# EAGLE design PCB-SSB-1x1ENC (EAGLE 7.5.0)

## Sheet 1 of 2
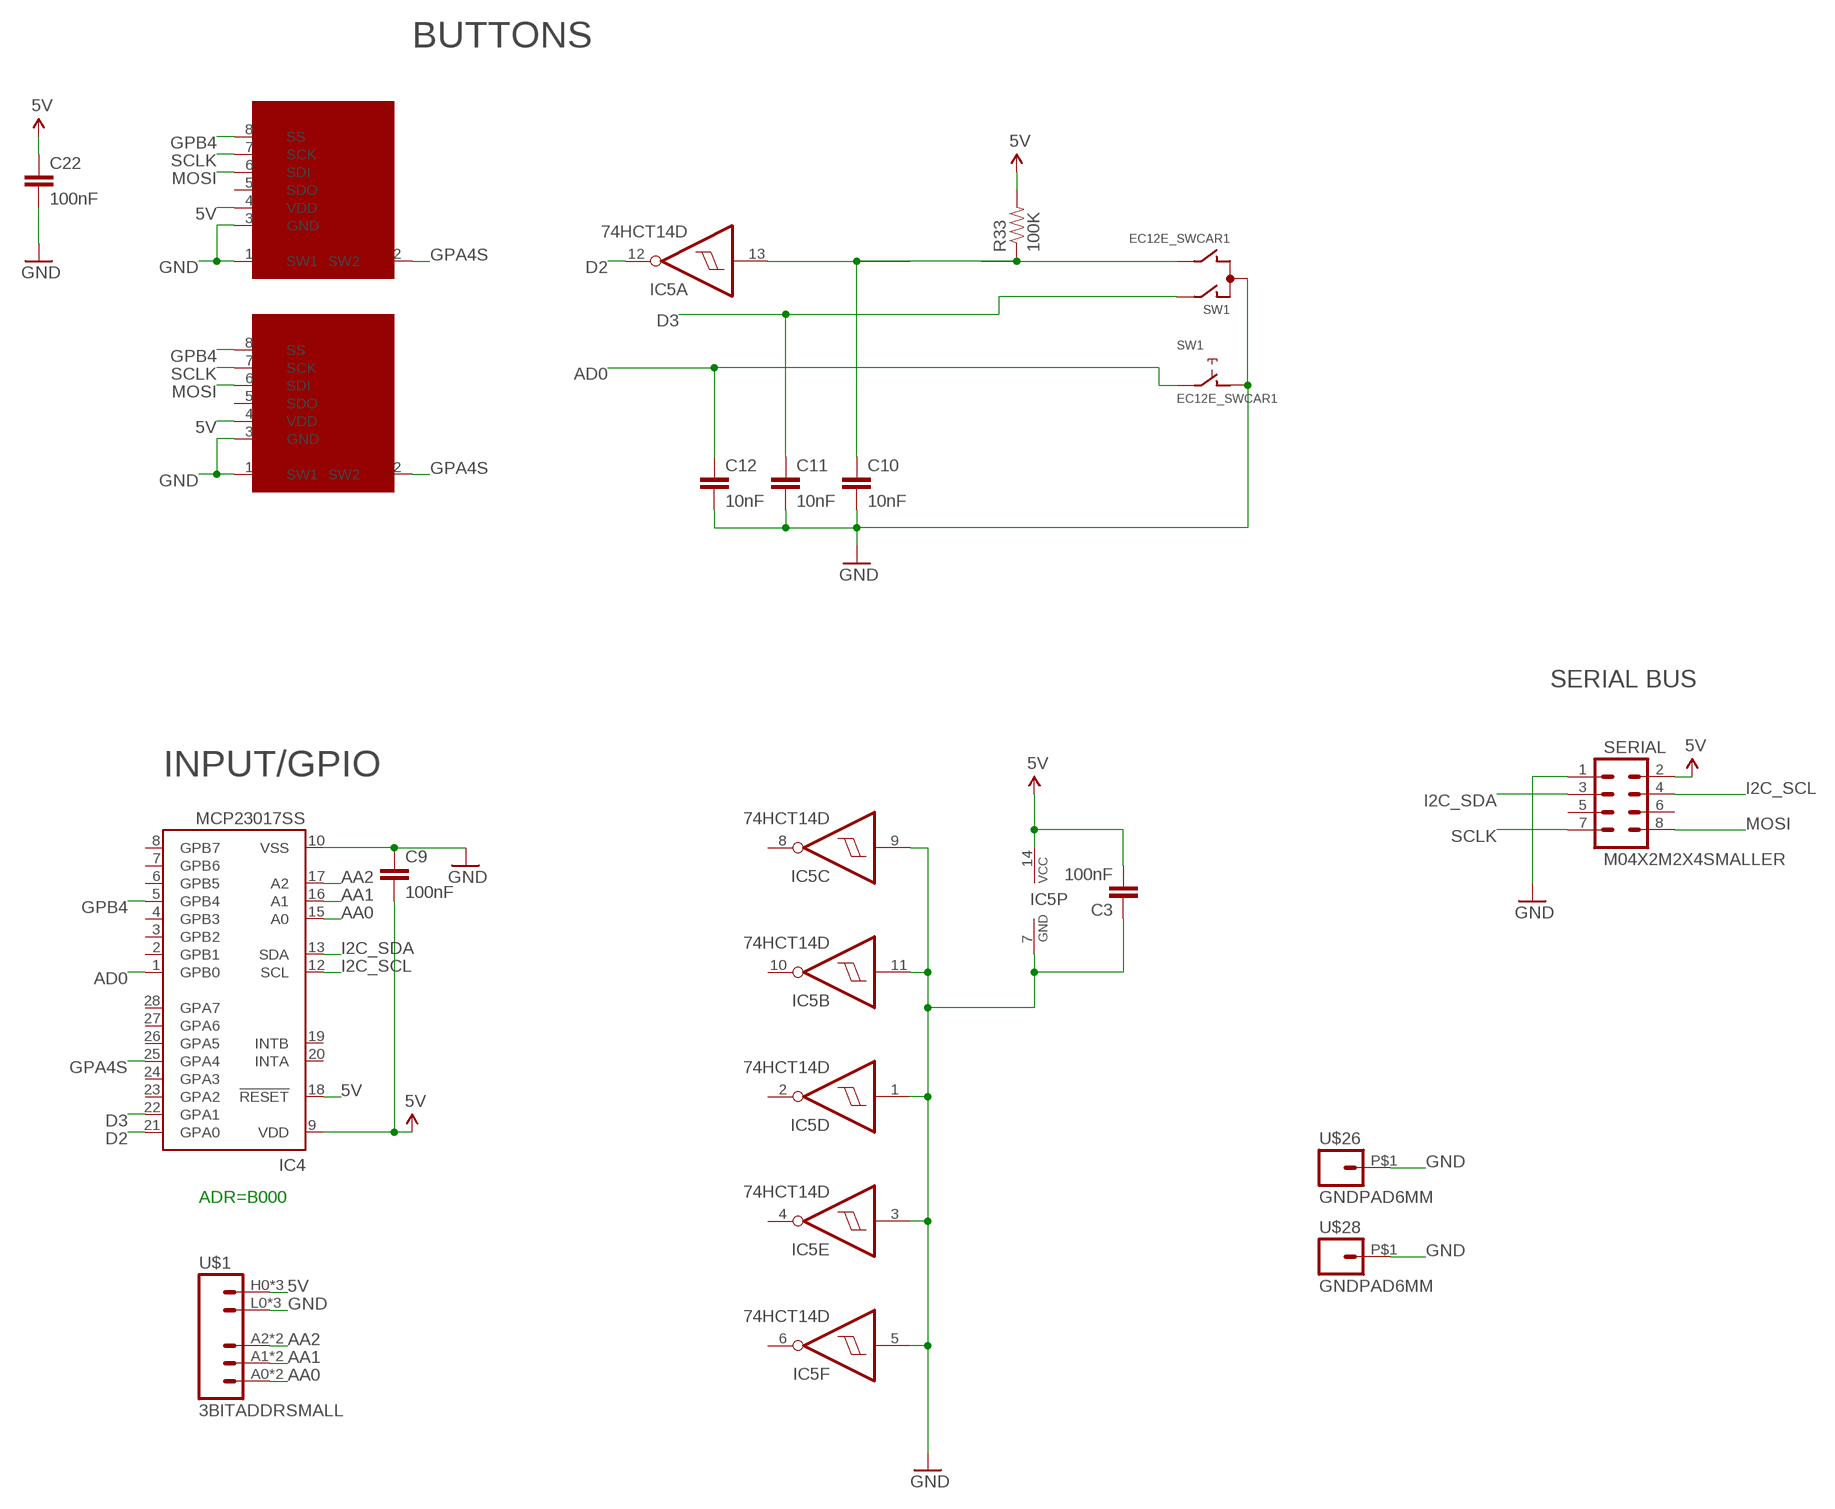
[diagram p0: schematic, sheet 1]

### Parts
C3  100nF  CAP0603-CAP  [0603-CAP]
C9  100nF  CAP0603-CAP  [0603-CAP]
C10  10nF  CAP0603-CAP  [0603-CAP]
C11  10nF  CAP0603-CAP  [0603-CAP]
C12  10nF  CAP0603-CAP  [0603-CAP]
C22  100nF  CAP0603-CAP  [0603-CAP]
IC4  MCP23017SS  [SSOP28]
IC5  74HCT14D  [SO14]
R33  100K  RESISTOR0603-RES  [0603-RES]
SERIAL  M04X2M2X4SMALLER  [M2X4SMALLER]
SSW1  SMART_SWITCHSMART_SWITCH_8PIN  [SMART_SWITCH]
SSW1ALT  SMART_SWITCHSMART_SWITCH_8PIN  [SMART_SWITCH]
SW1  EC12E_SWCAR1  [ALPS_EC12E_SW-CAR1]
U$1  3BITADDRSMALL  [3BITADDR_SMALL]
U$26  GNDPAD6MM  [3.2MMPAD6MM]
U$28  GNDPAD6MM  [3.2MMPAD6MM]

### Nets
5V [Power]: C3.2 C9.2 C22.1 IC4.9(VDD) IC4.18(!RESET) IC5.14(P:VCC) R33.2 SERIAL.2 SSW1.4(VDD) SSW1ALT.4(VDD) U$1.H0(VCC) U$1.H1(VCC) U$1.H2(VCC)
AA0: IC4.15(A0) U$1.A0 U$1.AS0(A0)
AA1: IC4.16(A1) U$1.A1 U$1.AS1(A1)
AA2: IC4.17(A2) U$1.A2 U$1.AS2(A2)
AD0: C12.1 IC4.1(GPB0) SW1.E
D2: IC4.21(GPA0) IC5.12(A:O)
D3: C11.1 IC4.22(GPA1) SW1.A
GND [Power]: C3.1 C9.1 C10.2 C11.2 C12.2 C22.2 IC4.10(VSS) IC5.1(D:I) IC5.3(E:I) IC5.5(F:I) IC5.7(P:GND) IC5.9(C:I) IC5.11(B:I) SERIAL.1 SSW1.1(SW1) SSW1.3(GND) SSW1ALT.1(SW1) SSW1ALT.3(GND) SW1.C SW1.D U$1.L0(GND) U$1.L1(GND) U$1.L2(GND) U$26.P$1 U$28.P$1
GPA4S: IC4.25(GPA4) SSW1.2(SW2) SSW1ALT.2(SW2)
GPB4: IC4.5(GPB4) SSW1.8(SS) SSW1ALT.8(SS)
I2C_SCL: IC4.12(SCL) SERIAL.4
I2C_SDA: IC4.13(SDA) SERIAL.3
MOSI: SERIAL.8 SSW1.6(SDI) SSW1ALT.6(SDI)
N$33: C10.1 IC5.13(A:I) R33.1 SW1.B
SCLK: SERIAL.7 SSW1.7(SCK) SSW1ALT.7(SCK)
Unconnected: IC4.2(GPB1) IC4.3(GPB2) IC4.4(GPB3) IC4.6(GPB5) IC4.7(GPB6) IC4.8(GPB7) IC4.19(INTB) IC4.20(INTA) IC4.23(GPA2) IC4.24(GPA3) IC4.26(GPA5) IC4.27(GPA6) IC4.28(GPA7) IC5.2(D:O) IC5.4(E:O) IC5.6(F:O) IC5.8(C:O) IC5.10(B:O) SERIAL.5 SERIAL.6 SSW1.5(SDO) SSW1ALT.5(SDO) SW1.GND1(G) SW1.GND2(G)

### Notes on the sheet
- BUTTONS
- SERIAL BUS
- INPUT/GPIO
- ADR=B000

## Sheet 2 of 2

## Library data of the parts
C3 C9-C12 C22 = SparkFun:CAP: Capacitor Standard 0603 ceramic capacitor, and 0.1" leaded capacitor.
IC4 = microchip:MCP23017: http://ww1.microchip.com/downloads/en/DeviceDoc/21952a.pdf Source: http://ww1.microchip.com/downloads/en/DeviceDoc/21952a.pdf; MF: MICROCHIP; MPN: MCP23017-E/SS; OC_FARNELL: 1467674; OC_NEWARK: 31K2960
IC5 = 74xx-eu:74*14: Hex schmitt trigger INVERTER
R33 = SparkFun:RESISTOR: Resistor Basic schematic elements and footprints for 0603, 1206, and PTH resistors.
SERIAL = SKAARHOJ:M04X2
SSW1 SSW1ALT = SKAARHOJ:SMART_SWITCH: SMARTSWITCH IS15DSBFP4RGB www.nkksmartswitch.com
SW1 = SKAARHOJ:EC12E_SW: ALPS rotary Encoder EC12E series with switch
U$1 = SKAARHOJ:3BITADDR
U$26 U$28 = SKAARHOJ:GNDPAD

## Net classes
0 default: width 0.203 mm, drill 0.406 mm, clearance 0.152 mm
1 Power: width 0.406 mm, drill 0.61 mm, clearance 0.203 mm

## Board
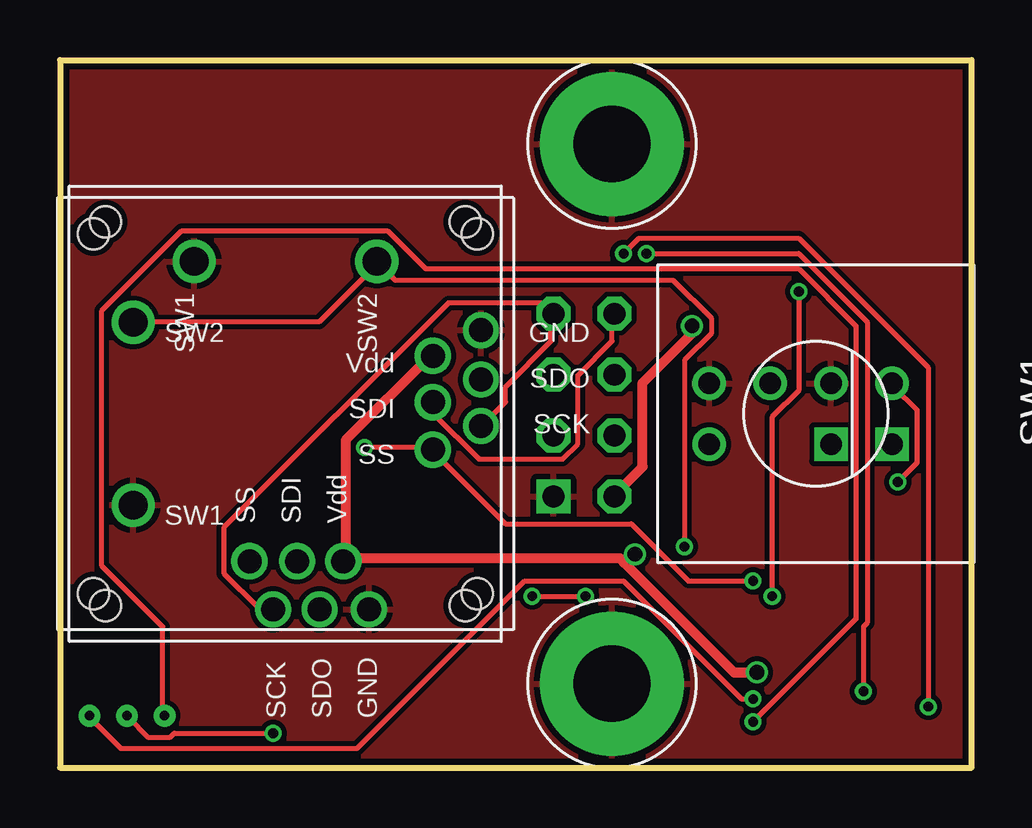
[diagram p1: board, top side]
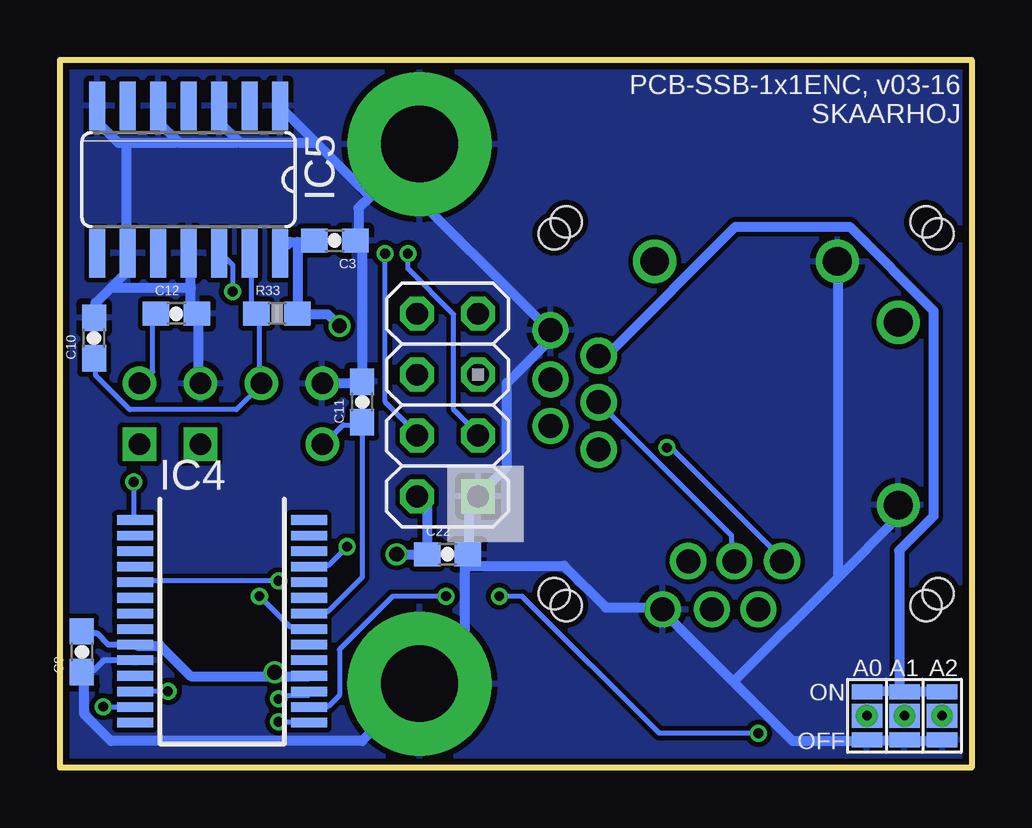
[diagram p2: board, bottom side, seen from below]

Size 38 x 29.5 mm. Coordinates in mm from the lower left corner, seen from the top.
Outline: 0,29.5 0,0 38,0 38,29.5 0,29.5
Copper layers (1*16): Top 0.035mm / dielectric 1.5mm / Bottom 0.035mm
Design rules "Fusion_eagle_rule_v1.1": minimum track width 6mil, minimum drill 12mil, track to track 6mil, track to pad 6mil, pad to pad 6mil, via to via 6mil, smd to smd 0mil, copper to edge 10mil, drill to drill 10mil, minimum pad ring 10mil, minimum via ring 6mil, stop-mask expansion 2mil, vias tented up to drill 100mil, thermal gap 10mil

### Footprints (pad centres in the part's own frame; a part is rotated, then mirrored left to right if it is on the bottom)
0603-CAP = smd 1.1 x 1: 1 -0.85,0; 2 0.85,0
SSOP28 = smd 0.4 x 1.5: 1 -4.225,-3.625; 2 -3.575,-3.625; 3 -2.925,-3.625; 4 -2.275,-3.625; 5 -1.625,-3.625; 6 -0.975,-3.625; 7 -0.325,-3.625; 8 0.325,-3.625; 9 0.975,-3.625; 10 1.625,-3.625; 11 2.275,-3.625; 12 2.925,-3.625; 13 3.575,-3.625; 14 4.225,-3.625; 15 4.225,3.625; 16 3.575,3.625; 17 2.925,3.625; 18 2.275,3.625; 19 1.625,3.625; 20 0.975,3.625; 21 0.325,3.625; 22 -0.325,3.625; 23 -0.975,3.625; 24 -1.625,3.625; 25 -2.275,3.625; 26 -2.925,3.625; 27 -3.575,3.625; 28 -4.225,3.625
SO14 = smd 0.66 x 2.032: 1 -3.81,-3.073; 2 -2.54,-3.073; 3 -1.27,-3.073; 4 0,-3.073; 5 1.27,-3.073; 6 2.54,-3.073; 7 3.81,-3.073; 8 3.81,3.073; 9 2.54,3.073; 10 1.27,3.073; 11 0,3.073; 12 -1.27,3.073; 13 -2.54,3.073; 14 -3.81,3.073
0603-RES = smd 1.1 x 1: 1 -0.85,0; 2 0.85,0
M2X4SMALLER = drill 0.9 square: 1 -1.27,3.81 | drill 0.9 octagon: 2 1.27,3.81; 3 -1.27,1.27; 4 1.27,1.27; 5 -1.27,-1.27; 6 1.27,-1.27; 7 -1.27,-3.81; 8 1.27,-3.81
SMART_SWITCH = drill 1.2: 1 6.35,3.81; 2 6.35,-3.81 | drill 1: 3 -8.153,-3.48; 4 -6.147,-2.413; 5 -8.153,-1.422; 6 -6.147,-0.483; 7 -8.153,0.508; 8 -6.147,1.499 | hole 1.3: -8.001,7.506; 8.001,7.506; 8.001,-7.506; -8.001,-7.506
ALPS_EC12E_SW-CAR1 = drill 0.9: A 1.27,-4.445; B -1.27,-1.905; C -1.27,-4.445; D -1.27,0.635; E -1.27,3.175 | drill 0.9 square: GND1 1.27,3.175; GND2 1.27,0.635
3BITADDR_SMALL = drill 0.4: A0 -1.565,0; A1 0,0; A2 1.565,0 | smd 1.27 x 1: AS0 -1.565,0; AS1 0,0; AS2 1.565,0 | smd 1.27 x 0.635: H0 -1.565,1; H1 0,1; H2 1.565,1; L0 -1.565,-1; L1 0,-1; L2 1.565,-1
3.2MMPAD6MM = drill 3.2 pad 6: P$1 0,0

### Placement (x,y rotation side)
C3  26.54,21.97 180 bottom
C9  37.08,4.83 90 bottom
C10  36.58,17.91 90 bottom
C11  25.4,15.24 90 bottom
C12  33.15,18.92 0 bottom
C22  21.84,8.89 0 bottom
IC4  31.24,6.1 270 bottom
IC5  32.64,24.51 180 bottom
R33  28.96,18.92 0 bottom
SERIAL  21.84,15.11 180 bottom
SSW1  9.4,14.75 180 top
SSW1ALT  9.4,14.75 90 top
SW1  31.51,14.75 270 top
U$1  2.79,2.16 0 bottom
U$26  23.01,26 0 top
U$28  23.01,3.5 0 top

### Tracks (layer width: path | path; a pad name or v marks a point on that pad's centre or on a via)
5V  (via drill 0.61)
  Top 0.406: v26.35,18.41 26.35,18.1 24.29,16.03 24.29,12.54 23.18,11.43 SERIAL.2 | SSW1.4 15.4,17.14 11.91,13.65 11.91,8.73 SSW1ALT.4 12.06,8.73 23.34,8.73 23.57,8.49 | v29.05,3.97 28.1,3.97 23.57,8.49 | 23.57,8.49 v23.97,8.89
  Bottom 0.254: IC4.9 35.98,5.12 36.45,5.59 37,5.59 C9.2
  Bottom 0.406: 28.1,21.91 28.42,21.91 28.73,21.59 IC5.14 | 28.1,21.91 27.46,21.91 C3.2 | 28.1,21.91 28.1,19.05 R33.2 27.94,18.89 26.83,18.89 v26.35,18.41 | SERIAL.2 23.02,11.27 22.7,10.95 22.7,8.89 C22.1 v23.97,8.89 | 29.05,3.81 32.54,3.81 33.81,5.08 34.77,5.08 IC4.9 | 29.05,3.81 IC4.18 | U$1.H2 1.27,3.17 2.7,3.17 U$1.H1 | U$1.H0 4.29,3.17 2.86,3.17 U$1.H1 | U$1.H1 3.02,3.33 3.02,9.05 1.59,10.48 1.59,19.05 5.08,22.54 9.84,22.54 15.08,17.3 15.4,17.3 SSW1.4 | v29.05,3.97 29.05,3.81
AA0  (via drill 0.41)
  Top 0.203: v28.89,1.91 33.18,6.19 33.18,18.41 30.8,20.8 15.24,20.8 13.65,22.38 5.08,22.38 1.75,19.05 1.75,8.41 4.29,5.87 4.29,2.22 U$1.AS0
  Bottom 0.203: 4.45,2.22 U$1.AS0 | v28.89,1.91 27.62,1.91 IC4.15
AA1  (via drill 0.41)
  Top 0.203: v19.68,7.14 v21.91,7.14 | v8.89,1.43 4.76,1.43 4.6,1.27 3.65,1.27 2.86,2.06 U$1.AS1
  Bottom 0.203: 2.86,2.22 U$1.AS1 | v21.91,7.14 24.13,7.14 26.35,4.92 26.35,3.02 26.83,2.54 27.46,2.54 IC4.16 | v19.68,7.14 18.73,7.14 13.02,1.43 v8.89,1.43
AA2  (via drill 0.41)
  Top 0.203: v28.89,2.86 28.42,2.86 23.5,7.78 19.37,7.78 12.38,0.79 2.54,0.79 1.27,2.06 U$1.AS2
  Bottom 0.203: 1.27,2.22 U$1.AS2 | v28.89,2.86 28.73,3.02 27.62,3.02 IC4.17
AD0  (via drill 0.41)
  Top 0.203: v34.92,11.91 35.72,12.7 35.72,14.92 34.77,15.88 SW1.E
  Bottom 0.203: C12.1 34.13,18.89 34.13,16.51 34.61,16.03 SW1.E | v34.92,11.91 34.92,10.48 IC4.1
D2  (via drill 0.41)
  Top 0.203: v29.69,7.14 29.69,14.61 30.8,15.72 v30.8,19.84
  Bottom 0.203: v29.69,7.14 28.42,5.87 27.62,5.87 IC4.21 | v30.8,19.84 30.8,20.95 31.27,21.43 IC5.12
D3
  Bottom 0.203: 25.4,14.29 26.19,14.29 26.99,13.49 SW1.A | 25.4,14.29 25.4,7.94 26.83,6.51 27.46,6.51 IC4.22 | 25.4,14.29 C11.1
GND
  Bottom 0.254: IC4.10 36.17,4.47 36.58,4.06 37,4.06 C9.1
  Bottom 0.406: SW1.D 32.23,16.03 32.23,18.89 C12.2 32.38,19.05 32.54,19.21 32.54,20 | 32.54,20 32.54,21.43 IC5.11 | SW1.C 26.99,16.03 25.4,16.03 C11.2 25.4,22.07 C3.1 25.56,22.07 25.56,23.34 25.08,23.81 | 35.8,20.08 35.24,20.64 35.24,21.43 IC5.9 35.24,21.59 35.24,26.04 | 35.8,20.08 36.51,19.37 36.51,18.89 C10.2 | 24.13,24.77 23.02,25.88 U$26.P$1 24.13,24.77 | 24.13,24.77 25.08,23.81 | 25.08,23.81 27.38,26.11 | 27.38,26.11 28.73,27.46 IC5.1 | 30.56,26.11 30.48,26.04 27.46,26.04 27.38,26.11 | 30.56,26.11 31.27,26.83 31.27,27.46 IC5.3 | 33.1,26.11 33.02,26.04 30.64,26.04 30.56,26.11 | 33.1,26.11 33.81,26.83 33.81,27.46 IC5.5 | 35.24,26.04 33.18,26.04 33.1,26.11 | 35.24,26.04 35.56,26.04 36.35,26.83 36.35,27.46 IC5.7 | 24.13,24.77 17.62,18.26 SSW1.3 17.62,18.1 17.62,17.78 19.37,16.03 19.37,12.54 20.48,11.43 SERIAL.1 20.64,11.27 20.95,10.95 20.95,8.89 C22.2 | 32.54,20 35.72,20 35.8,20.08 | U$1.L2 1.27,1.11 2.7,1.11 U$1.L1 2.86,1.11 4.29,1.11 U$1.L0 4.45,1.11 7.46,1.11 9.92,3.57 | 9.92,3.57 12.86,6.51 SSW1ALT.3 13.02,6.67 15.24,6.67 16.99,8.41 20.95,8.41 C22.2 | 9.92,3.57 5.48,8.02 | 5.48,8.02 3.17,10.32 3.17,10.79 SSW1.1 | SSW1ALT.1 5.56,20.95 5.56,8.1 5.48,8.02 | C9.1 36.99,3.97 36.99,2.22 35.88,1.11 25.4,1.11 U$28.P$1 22.86,3.65 21.11,5.4 21.11,8.73 C22.2
  pour Top: 0,0 38.1,0 38.1,29.21 0,29.21
  pour Bottom: 0,0 38.1,0 38.1,29.21 0,29.21
GPA4S  (via drill 0.41)
  Top 0.203: v26.04,9.21 26.04,16.99 27.15,18.1 27.15,18.73 25.56,20.32 13.97,20.32 13.34,20.95 SSW1ALT.2 13.18,20.95 10.79,18.57 3.17,18.57 SSW1.2
  Bottom 0.203: v26.04,9.21 26.83,8.41 27.46,8.41 IC4.25
GPB4  (via drill 0.41)
  Top 0.203: v28.89,7.78 26.19,7.78 23.81,10.16 18.57,10.16 15.56,13.18 SSW1.8 15.4,13.34 v12.7,13.34
  Bottom 0.203: v28.89,7.78 34.77,7.78 IC4.5 | v12.7,13.34 12.54,13.34 7.94,8.73 SSW1ALT.8
I2C_SCL  (via drill 0.41)
  Top 0.203: v33.5,3.17 33.5,5.87 33.66,6.03 33.66,18.57 30.8,21.43 v24.45,21.43
  Bottom 0.203: v33.5,3.17 34.77,3.17 IC4.12 | v24.45,21.43 24.45,15.24 23.18,13.97 SERIAL.4
I2C_SDA  (via drill 0.41)
  Top 0.203: v36.2,2.54 36.2,16.67 30.8,22.07 24.13,22.07 v23.5,21.43
  Bottom 0.203: v36.2,2.54 34.92,2.54 IC4.13 | v23.5,21.43 23.5,20.8 21.59,18.89 21.59,14.92 20.64,13.97 SERIAL.3
MOSI
  Top 0.203: SERIAL.8 23.02,18.89 23.02,17.78 21.59,16.35 21.59,13.49 20.95,12.86 17.46,12.86 15.56,14.76 15.56,15.08 SSW1.6
  Bottom 0.203: SSW1ALT.6 10,8.73 10,9.68 15.4,15.08 SSW1.6
N$33
  Bottom 0.203: C10.1 36.51,16.99 36.51,16.35 35.08,14.92 30.64,14.92 29.69,15.88 SW1.B 29.69,16.03 29.69,18.89 R33.1 29.84,19.05 30,19.21 30,21.43 IC5.13
SCLK
  Top 0.203: SSW1.7 17.62,14.29 18.57,15.24 18.57,15.88 20.48,17.78 20.48,18.89 SERIAL.7 20.48,19.05 20.16,19.37 16.19,19.37 6.83,10 6.83,8.1 8.26,6.67 8.89,6.67 SSW1ALT.7

### Text on the board
_bsilk: PCB-SSB-1x1ENC, v03-16 / SKAARHOJ